# EAGLE schematic ubraidsII (EAGLE 7.5.0)

## Sheet 1 of 3
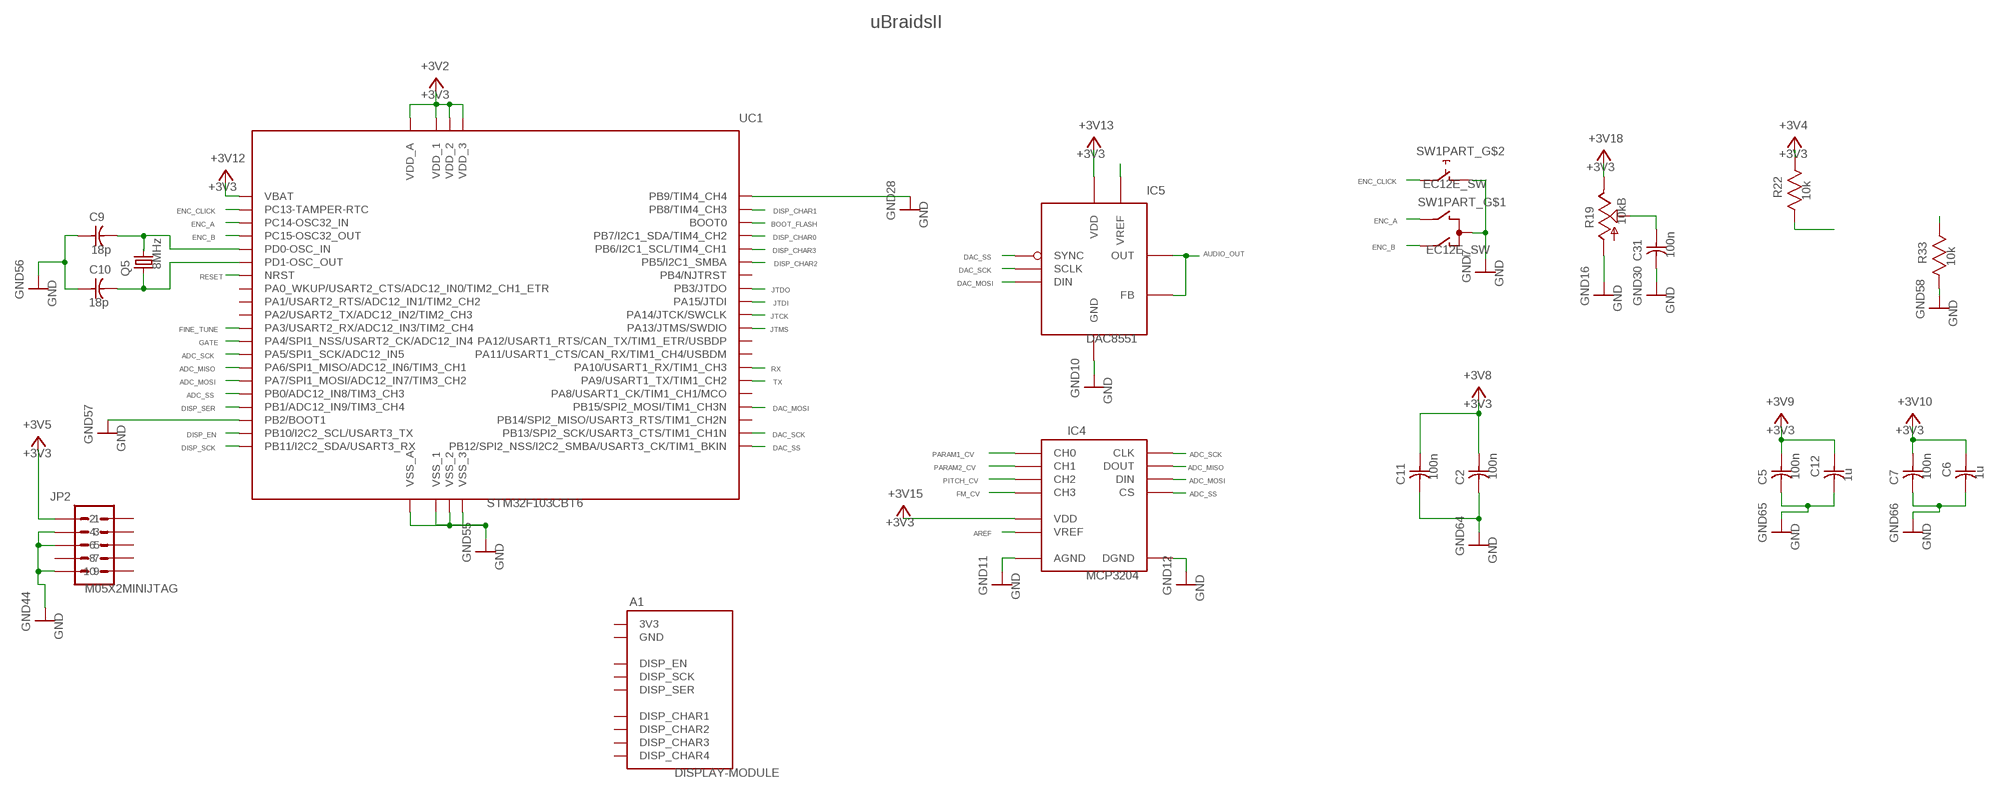
[diagram p0: schematic, sheet 1]

### Parts
A1  DISPLAY-MODULE  [DISPLAY-MODULE]
C2  100n  CAP_0603  [CAP_0603]
C5  100n  CAP_0603  [CAP_0603]
C6  1u  CAP_0603  [CAP_0603]
C7  100n  CAP_0603  [CAP_0603]
C9  18p  CAP_0603  [CAP_0603]
C10  18p  CAP_0603  [CAP_0603]
C11  100n  CAP_0603  [CAP_0603]
C12  1u  CAP_0603  [CAP_0603]
C31  100n  CAP_0603  [CAP_0603]
IC4  MCP3204  MCP3302  [TSSOP-14]
IC5  DAC8551  DAC855X  [MSOP-8]
JP2  M05X2MINIJTAG  [2X5-1.27]
Q5  8MHz  CRYSTALHC49UP  [HC49UP]
R19  10kB  FINE  [9mm_Alpha/Bourns_Pot]
R22  10k  RES_0603  [RES_0603]
R33  10k  RES_0603  [RES_0603]
SW1  EC12E_SW  [ALPS_EC12E_SW]
UC1  STM32F103CBT6  STM32F103CB  [LQFP48]

### Nets
+3V3: A1.5(3V3) C2.1 C5.1 C6.1 C7.1 C11.1 C12.1 IC4.14(VDD) IC5.1(VDD) JP2.1 R19.3(E) R22.2 UC1.1(VBAT) UC1.9(VDD_A) UC1.24(VDD_1) UC1.36(VDD_2) UC1.48(VDD_3) ; also sheet 2,3
ADC_MISO: IC4.10(DOUT) UC1.16(PA6/SPI1_MISO/ADC12_IN6/TIM3_CH1)
ADC_MOSI: IC4.9(DIN) UC1.17(PA7/SPI1_MOSI/ADC12_IN7/TIM3_CH2)
ADC_SCK: IC4.11(CLK) UC1.15(PA5/SPI1_SCK/ADC12_IN5)
ADC_SS: IC4.8(CS) UC1.18(PB0/ADC12_IN8/TIM3_CH3)
AREF: IC4.13(VREF) IC5.2(VREF) ; also sheet 3
AUDIO_OUT: IC5.3(FB) IC5.4(OUT) ; also sheet 2
BOOT_FLASH: R33.2 UC1.44(BOOT0)
DAC_MOSI: IC5.7(DIN) UC1.28(PB15/SPI2_MOSI/TIM1_CH3N)
DAC_SCK: IC5.6(SCLK) UC1.26(PB13/SPI2_SCK/USART3_CTS/TIM1_CH1N)
DAC_SS: IC5.5(SYNC) UC1.25(PB12/SPI2_NSS/I2C2_SMBA/USART3_CK/TIM1_BKIN)
DISP_CHAR0: A1.9(DISP_CHAR3) UC1.43(PB7/I2C1_SDA/TIM4_CH2)
DISP_CHAR1: A1.6(DISP_CHAR4) UC1.45(PB8/TIM4_CH3)
DISP_CHAR2: A1.14(DISP_CHAR1) UC1.41(PB5/I2C1_SMBA)
DISP_CHAR3: A1.13(DISP_CHAR2) UC1.42(PB6/I2C1_SCL/TIM4_CH1)
DISP_EN: A1.1(DISP_EN) UC1.21(PB10/I2C2_SCL/USART3_TX)
DISP_SCK: A1.2(DISP_SCK) UC1.22(PB11/I2C2_SDA/USART3_RX)
DISP_SER: A1.3(DISP_SER) UC1.19(PB1/ADC12_IN9/TIM3_CH4)
ENC_A: SW1.B(PART_G$1:B) UC1.3(PC14-OSC32_IN)
ENC_B: SW1.A(PART_G$1:A) UC1.4(PC15-OSC32_OUT)
ENC_CLICK: SW1.E UC1.2(PC13-TAMPER-RTC)
FINE_TUNE: C31.1 R19.2(S) UC1.13(PA3/USART2_RX/ADC12_IN3/TIM2_CH4)
FM_CV: IC4.4(CH3) ; also sheet 2
GATE: UC1.14(PA4/SPI1_NSS/USART2_CK/ADC12_IN4) ; also sheet 2
GND: A1.4(GND) A1.7(GND) C2.2 C5.2 C6.2 C7.2 C9.1 C10.1 C11.2 C12.2 C31.2 IC4.7(DGND) IC4.12(AGND) IC5.8(GND) JP2.3 JP2.5 JP2.9 R19.1(A) R33.1 SW1.C(PART_G$1:C) SW1.D UC1.8(VSS_A) UC1.20(PB2/BOOT1) UC1.23(VSS_1) UC1.35(VSS_2) UC1.46(PB9/TIM4_CH4) UC1.47(VSS_3) ; also sheet 2,3
JTCK: JP2.4 UC1.37(PA14/JTCK/SWCLK)
JTDI: JP2.8 UC1.38(PA15/JTDI)
JTDO: JP2.6 UC1.39(PB3/JTDO)
JTMS: JP2.2 UC1.34(PA13/JTMS/SWDIO)
N$7: C9.2 Q5.2 UC1.5(PD0-OSC_IN)
N$8: C10.2 Q5.1 UC1.6(PD1-OSC_OUT)
PARAM1_CV: IC4.1(CH0) ; also sheet 2
PARAM2_CV: IC4.2(CH1) ; also sheet 2
PITCH_CV: IC4.3(CH2) ; also sheet 2
RESET: JP2.10 R22.1 UC1.7(NRST)
RX: UC1.31(PA10/USART1_RX/TIM1_CH3)
TX: UC1.30(PA9/USART1_TX/TIM1_CH2)
Unconnected: JP2.7 UC1.10(PA0_WKUP/USART2_CTS/ADC12_IN0/TIM2_CH1_ETR) UC1.11(PA1/USART2_RTS/ADC12_IN1/TIM2_CH2) UC1.12(PA2/USART2_TX/ADC12_IN2/TIM2_CH3) UC1.27(PB14/SPI2_MISO/USART3_RTS/TIM1_CH2N) UC1.29(PA8/USART1_CK/TIM1_CH1/MCO) UC1.32(PA11/USART1_CTS/CAN_RX/TIM1_CH4/USBDM) UC1.33(PA12/USART1_RTS/CAN_TX/TIM1_ETR/USBDP) UC1.40(PB4/NJTRST)

### Notes on the sheet
- uBraidsII

## Sheet 2 of 3
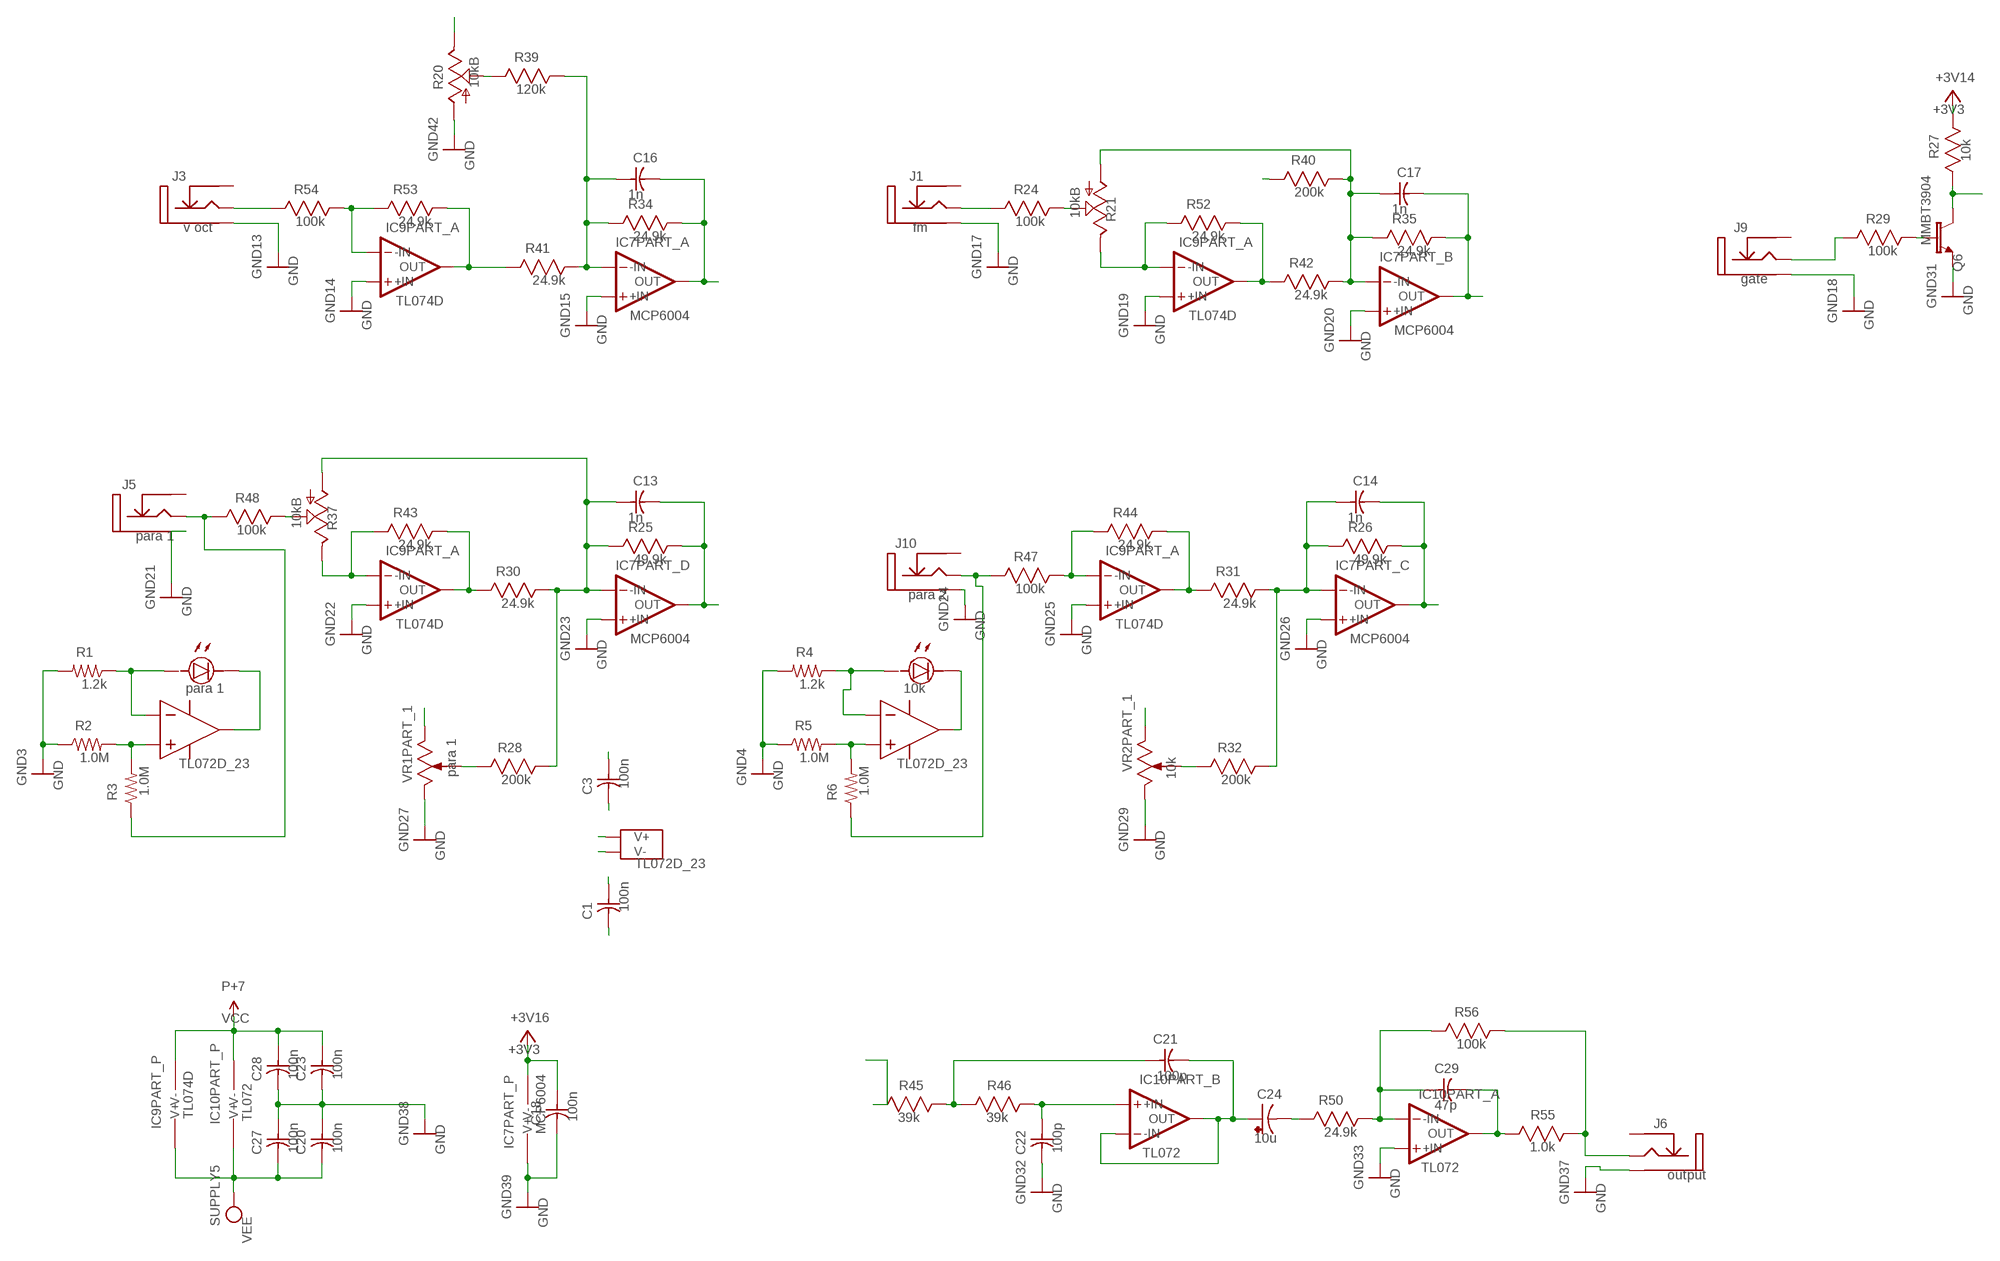
[diagram p1: schematic, sheet 2]

### Parts
C1  100n  CAP_0603  [CAP_0603]
C3  100n  CAP_0603  [CAP_0603]
C13  1n  CAP_0603  [CAP_0603]
C14  1n  CAP_0603  [CAP_0603]
C16  1n  CAP_0603  [CAP_0603]
C17  1n  CAP_0603  [CAP_0603]
C18  100n  CAP_0603  [CAP_0603]
C20  100n  CAP_0603  [CAP_0603]
C21  100p  CAP_0603  [CAP_0603]
C22  100p  CAP_0603  [CAP_0603]
C23  100n  CAP_0603  [CAP_0603]
C24  10u  CPOL-USB  [PANASONIC_B]
C27  100n  CAP_0603  [CAP_0603]
C28  100n  CAP_0603  [CAP_0603]
C29  47p  CAP_0603  [CAP_0603]
IC7  MCP6004  TL074D  [TSSOP-14]
IC9  TL074D  [TSSOP-14]
IC10  TL072  TL072D  [TSSOP-8]
J1  fm  THONKICONN  [Thonkiconn_Jack]
J3  v oct  THONKICONN  [Thonkiconn_Jack]
J5  para 1  THONKICONN  [Thonkiconn_Jack]
J6  output  THONKICONN_31  [Thonkiconn_Jack]
J9  gate  THONKICONN  [Thonkiconn_Jack]
J10  para 2  THONKICONN  [Thonkiconn_Jack]
Q6  MMBT3904  MMBT3904LT1-NPN-SOT23-BEC  [SOT23-BEC]
R1  1.2k  R805  [RES_0603]
R2  1.0M  R805_13  [RES_0603]
R3  1.0M  R805_14  [RES_0603]
R4  1.2k  R805  [RES_0603]
R5  1.0M  R805_13  [RES_0603]
R6  1.0M  R805_14  [RES_0603]
R20  10kB  COARSE  [9mm_Alpha/Bourns_Pot]
R21  10kB  FM  [9mm_Alpha/Bourns_Pot]
R24  100k  RES_0603  [RES_0603]
R25  49.9k  RES_0603  [RES_0603]
R26  49.9k  RES_0603  [RES_0603]
R27  10k  RES_0603  [RES_0603]
R28  200k  RES_0603  [RES_0603]
R29  100k  RES_0603  [RES_0603]
R30  24.9k  RES_0603  [RES_0603]
R31  24.9k  RES_0603  [RES_0603]
R32  200k  RES_0603  [RES_0603]
R34  24.9k  RES_0603  [RES_0603]
R35  24.9k  RES_0603  [RES_0603]
R37  10kB  MODULATION  [9mm_Alpha/Bourns_Pot]
R39  120k  RES_0603  [RES_0603]
R40  200k  RES_0603  [RES_0603]
R41  24.9k  RES_0603  [RES_0603]
R42  24.9k  RES_0603  [RES_0603]
R43  24.9k  RES_0603  [RES_0603]
R44  24.9k  RES_0603  [RES_0603]
R45  39k  RES_0603  [RES_0603]
R46  39k  RES_0603  [RES_0603]
R47  100k  RES_0603  [RES_0603]
R48  100k  RES_0603  [RES_0603]
R50  24.9k  RES_0603  [RES_0603]
R52  24.9k  RES_0603  [RES_0603]
R53  24.9k  RES_0603  [RES_0603]
R54  100k  RES_0603  [RES_0603]
R55  1.0k  RES_0603  [RES_0603]
R56  100k  RES_0603  [RES_0603]
U6  TL072D_23  [SOIC-8/150mil]
VR1  para 1  BOURNS_PTL_LED_SLIDE_POT  [BOURNS_PTL_30mm]
VR2  10k  PARA_2  [BOURNS_PTL_30mm]

### Nets
+3V3: C18.1 IC7.4(PART_P:V+) R27.2 ; also sheet 1,3
AREF_-10: R20.3(E) R40.1 VR1.3(PART_1:CW) VR2.3(PART_1:CW) ; also sheet 3
AUDIO_OUT: R45.2 ; also sheet 1
FM_CV: C17.2 IC7.7(PART_B:OUT) R35.2 ; also sheet 1
GATE: Q6.C R27.1 ; also sheet 1
GND: C1.2 C3.1 C18.2 C20.1 C22.2 C23.2 C27.1 C28.2 IC7.3(PART_A:+IN) IC7.5(PART_B:+IN) IC7.10(PART_C:+IN) IC7.11(PART_P:V-) IC7.12(PART_D:+IN) IC9.3(PART_A:+IN) IC10.3(PART_A:+IN) J1.3(GND) J3.3(GND) J5.3(GND) J6.3(GND) J9.3(GND) J10.3(GND) Q6.E R1.2 R2.1 R4.2 R5.1 R20.1(A) VR1.1(PART_1:CCW) VR2.1(PART_1:CCW) ; also sheet 1,3
N$1: R2.2 R3.2 U6.3(PART_1:IN+)
N$12: IC9.1(PART_A:OUT) R41.1 R53.2
N$13: R20.2(S) R39.1
N$19: R1.1 U6.2(PART_1:IN-) VR1.5(PART_2:gnd)
N$29: C16.1 IC7.2(PART_A:-IN) R34.1 R39.2 R41.2
N$45: IC9.2(PART_A:-IN) R53.1 R54.2
N$48: R21.2(S) R24.2
N$50: IC9.2(PART_A:-IN) R37.3(E) R43.1
N$51: IC9.1(PART_A:OUT) R30.1 R43.2
N$52: IC9.2(PART_A:-IN) R21.3(E) R52.1
N$53: IC9.1(PART_A:OUT) R42.1 R52.2
N$55: C17.1 IC7.6(PART_B:-IN) R21.1(A) R35.1 R40.2 R42.2
N$58: IC9.1(PART_A:OUT) R31.1 R44.2
N$59: C13.1 IC7.13(PART_D:-IN) R25.1 R28.2 R30.2 R37.1(A)
N$61: R28.1 VR1.2(PART_1:W)
N$62: R37.2(S) R48.2
N$63: IC9.2(PART_A:-IN) R44.1 R47.2
N$65: R32.1 VR2.2(PART_1:W)
N$66: Q6.B R29.2
N$67: C21.2 C24.+ IC10.6(PART_B:-IN) IC10.7(PART_B:OUT)
N$68: C24.- R50.2
N$69: C22.1 IC10.5(PART_B:+IN) R46.1
N$70: C14.1 IC7.9(PART_C:-IN) R26.1 R31.2 R32.2
N$71: C21.1 R45.1 R46.2
N$72: J6.2(Tip) R55.1 R56.1
N$73: C29.2 IC10.1(PART_A:OUT) R55.2
N$75: C29.1 IC10.2(PART_A:-IN) R50.1 R56.2
Net_0: J9.2(Tip) R29.1
Net_1: J3.2(Tip) R54.1
Net_2: J5.2(Tip) R3.1 R48.1
Net_3: U6.7(PART_2:OUT) VR2.6(PART_2:gnd)
Net_12: U6.1(PART_1:OUT) VR1.6(PART_2:gnd)
Net_42: J1.2(Tip) R24.1
Net_55: J10.2(Tip) R6.1 R47.1
Net_80: R4.1 U6.6(PART_2:IN-) VR2.5(PART_2:gnd)
Net_81: R5.2 R6.2 U6.5(PART_2:IN+)
PARAM1_CV: C13.2 IC7.14(PART_D:OUT) R25.2 ; also sheet 1
PARAM2_CV: C14.2 IC7.8(PART_C:OUT) R26.2 ; also sheet 1
PITCH_CV: C16.2 IC7.1(PART_A:OUT) R34.2 ; also sheet 1
VCC: C3.2 C23.1 C28.1 IC9.4(PART_P:V+) IC10.8(PART_P:V+) U6.8(VCC_AND_GND:V+) ; also sheet 3
VEE: C1.1 C20.2 C27.2 IC9.11(PART_P:V-) IC10.4(PART_P:V-) U6.4(VCC_AND_GND:V-) ; also sheet 3
Unconnected: IC9.5(PART_B:+IN) IC9.6(PART_B:-IN) IC9.7(PART_B:OUT) IC9.8(PART_C:OUT) IC9.9(PART_C:-IN) IC9.10(PART_C:+IN) IC9.12(PART_D:+IN) IC9.13(PART_D:-IN) IC9.14(PART_D:OUT) J1.1(TN) J3.1(TN) J5.1(TN) J6.1(TN) J9.1(TN) J10.1(TN)

## Sheet 3 of 3
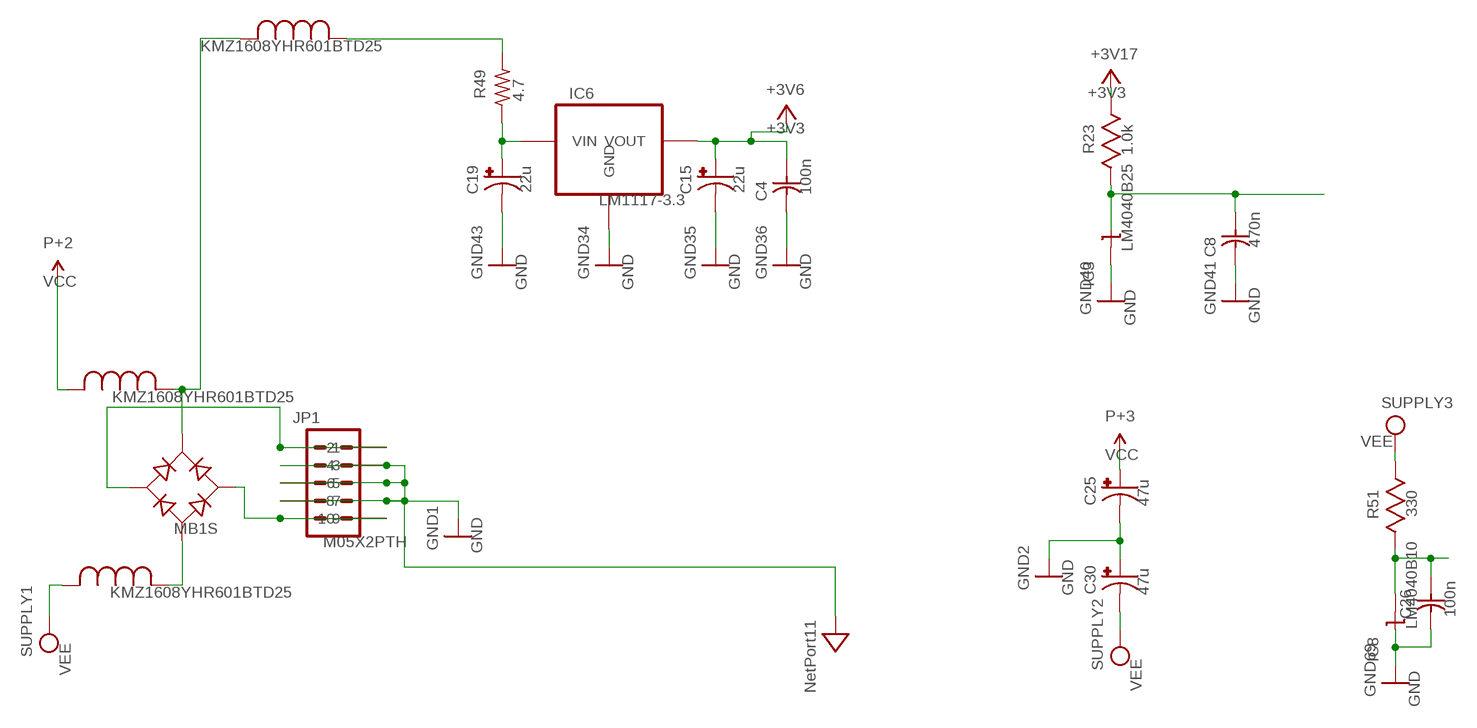
[diagram p2: schematic, sheet 3]

### Parts
C4  100n  CAP_0603  [CAP_0603]
C8  470n  CAP_0603  [CAP_0603]
C15  22u  CPOL-USC  [PANASONIC_C]
C19  22u  CPOL-USC  [PANASONIC_C]
C25  47u  CPOL-USD  [PANASONIC_D]
C26  100n  CAP_0603  [CAP_0603]
C30  47u  CPOL-USD  [PANASONIC_D]
D3  MB1S  [SOP-4/6.5x2.54]
IC3  LM4040B25  LM4041B12DBZ  [DBZ_R-PDSO-G3]
IC6  LM1117-3.3  REG1117T  [SOT223-4]
IC8  LM4040B10  LM4041B12DBZ_37  [DBZ_R-PDSO-G3]
JP1  M05X2PTH  [AVR_ICSP]
L1  KMZ1608YHR601BTD25  [IND_0603]
L2  KMZ1608YHR601BTD25  [IND_0603]
L4  KMZ1608YHR601BTD25  [IND_0603]
R23  1.0k  RES_0603  [RES_0603]
R49  4.7  R-US_R1206  [R1206]
R51  330  RES_0603  [RES_0603]

### Nets
+3V3: C4.1 C15.+ IC6.2(VOUT) IC6.4(VOUT) R23.1 ; also sheet 1,2
AREF: C8.1 IC3.1(C) R23.2 ; also sheet 1
AREF_-10: C26.1 IC8.2(A) R51.2 ; also sheet 2
GND: C4.2 C8.2 C15.- C19.- C25.- C26.2 C30.+ IC3.2(A) IC6.1(GND) IC8.1(C) JP1.3 JP1.4 JP1.5 JP1.6 JP1.7 JP1.8 ; supply symbol labelled GND_DIGITAL ; also sheet 1,2
N$49: C19.+ IC6.3(VIN) R49.1
N$56: D3.4(AC1) JP1.1 JP1.2
N$64: D3.3(AC2) JP1.9 JP1.10
Net_106: D3.1(+) L2.2 L4.1
Net_107: D3.2(-) L1.2
Net_110: L4.2 R49.2
VCC: C25.+ L2.1 ; also sheet 2
VEE: C30.- L1.1 R51.1 ; also sheet 2

## Library data of the parts
A1 = common:DISPLAY-MODULE
C1-C5 C7 C11 C18 C20 C23 C26-C28 C31 = common:CAP_0603
C6 C8-C10 C12-C14 C16 C17 C21 C22 C29 = common:CAP_0603; VALUE: 100n
C15 C19 = common:CPOL-USC
C24 = common:CPOL-USB
C25 C30 = common:CPOL-USD
D3 = common:MB1S
IC3 = common:LM4041B12DBZ
IC4 = common:MCP3302
IC5 = common:DAC855X
IC6 = common:REG1117T
IC7 = common:TL074D
IC8 = common:LM4041B12DBZ_37
IC9 = common:TL074D; VALUE: MCP6004
IC10 = common:TL072D
J1 = common:THONKICONN
J3 J5 J9 J10 = common:THONKICONN; VALUE: fm
J6 = common:THONKICONN_31
JP1 = common:M05X2PTH
JP2 = common:M05X2MINIJTAG
L1 L2 L4 = common:KMZ1608YHR601BTD25; DATASHEET: http://datasheets.diptrace.com/inductors/BR_series.pdf; MANUFACTURER: Taiyo Yuden
Q5 = common:CRYSTALHC49UP
Q6 = common:MMBT3904LT1-NPN-SOT23-BEC
R1 R4 = common:R805
R2 R5 = common:R805_13
R3 R6 = common:R805_14
R19 = common:FINE
R20 = common:COARSE
R21 = common:FM
R22 R27 R33 = common:RES_0603
R23-R26 R28-R32 R34 R35 R39-R48 R50-R56 = common:RES_0603; VALUE: 10k
R37 = common:MODULATION
R49 = common:R-US_R1206
SW1 = common:EC12E_SW
U6 = common:TL072D_23; DATASHEET: http://www.ti.com/lit/gpn/tl084
UC1 = common:STM32F103CB
VR1 = common:BOURNS_PTL_LED_SLIDE_POT; DATASHEET: http://www.bourns.com/data/global/pdfs/bourns_trimpot_catalog.pdf; MANUFACTURER: Bourns
VR2 = common:PARA_2; DATASHEET: http://www.bourns.com/data/global/pdfs/bourns_trimpot_catalog.pdf; MANUFACTURER: Bourns